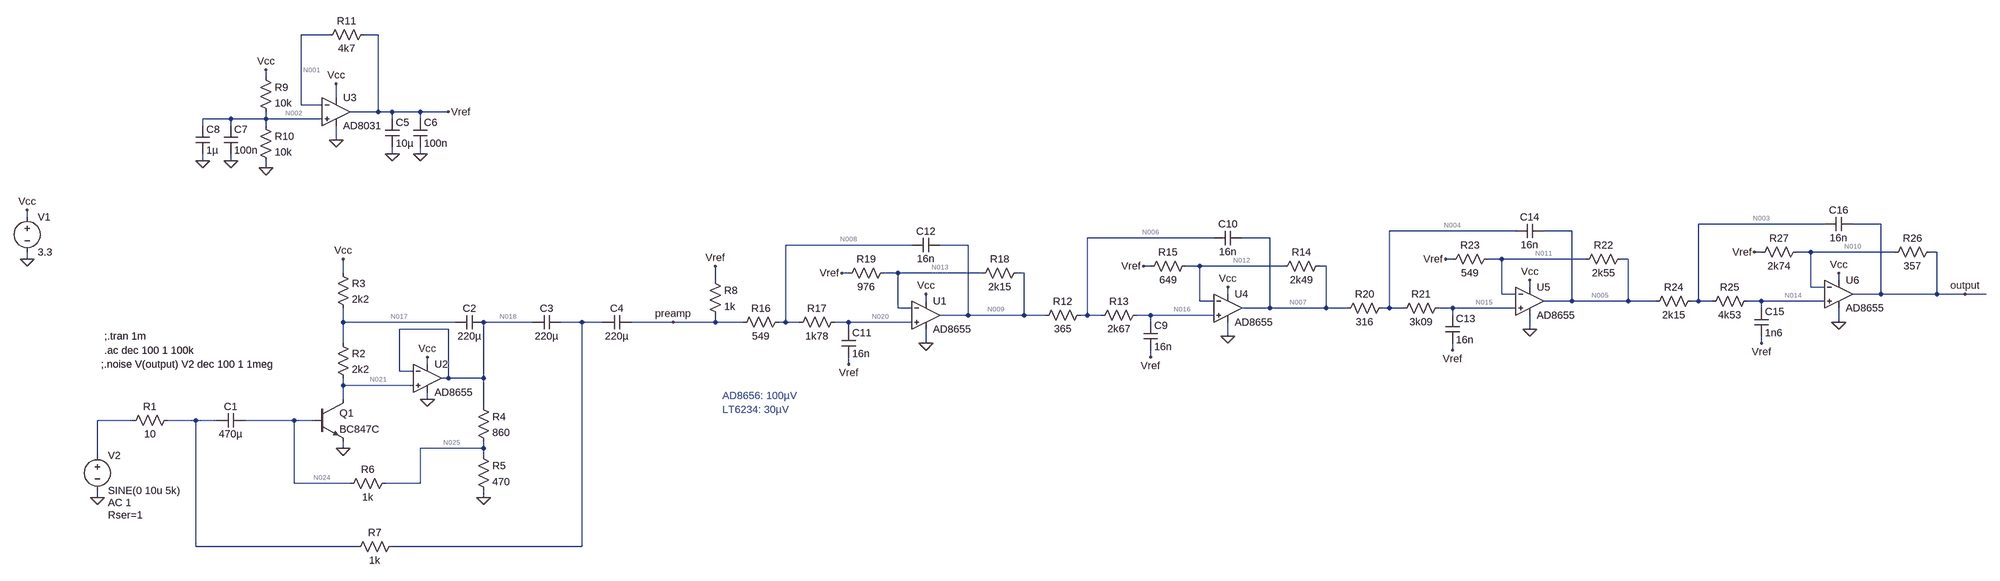
[diagram p0: schematic NPN.asc]
NPN.asc, the LTspice schematic file:
Version 4
SHEET 1 4504 900
WIRE 688 -336 624 -336
WIRE 800 -336 768 -336
WIRE 544 -240 544 -256
WIRE 704 -192 704 -224
WIRE 624 -176 624 -336
WIRE 672 -176 624 -176
WIRE 800 -160 800 -336
WIRE 800 -160 736 -160
WIRE 832 -160 800 -160
WIRE 896 -160 832 -160
WIRE 960 -160 896 -160
WIRE 464 -144 400 -144
WIRE 544 -144 544 -160
WIRE 544 -144 464 -144
WIRE 672 -144 544 -144
WIRE 832 -144 832 -160
WIRE 896 -144 896 -160
WIRE 400 -128 400 -144
WIRE 464 -128 464 -144
WIRE 544 -128 544 -144
WIRE 704 -96 704 -128
WIRE 832 -64 832 -80
WIRE 896 -64 896 -80
WIRE 400 -48 400 -64
WIRE 464 -48 464 -64
WIRE 544 -32 544 -48
WIRE 0 80 0 64
WIRE 4096 96 3808 96
WIRE 4224 96 4160 96
WIRE 3392 112 3104 112
WIRE 3520 112 3456 112
WIRE 2704 128 2416 128
WIRE 2832 128 2768 128
WIRE 2016 144 1728 144
WIRE 2144 144 2080 144
WIRE 3952 160 3936 160
WIRE 4064 160 4032 160
WIRE 4256 160 4064 160
WIRE 4352 160 4336 160
WIRE 0 176 0 160
WIRE 3248 176 3232 176
WIRE 3360 176 3328 176
WIRE 3552 176 3360 176
WIRE 3648 176 3632 176
WIRE 2560 192 2544 192
WIRE 2672 192 2640 192
WIRE 2864 192 2672 192
WIRE 2960 192 2944 192
WIRE 720 208 720 176
WIRE 1872 208 1856 208
WIRE 1984 208 1952 208
WIRE 2176 208 1984 208
WIRE 2272 208 2256 208
WIRE 1568 224 1568 192
WIRE 4128 224 4128 208
WIRE 3424 240 3424 224
WIRE 4064 240 4064 160
WIRE 4096 240 4064 240
WIRE 2736 256 2736 240
WIRE 3360 256 3360 176
WIRE 3392 256 3360 256
WIRE 4224 256 4224 96
WIRE 4224 256 4160 256
WIRE 4352 256 4352 160
WIRE 4352 256 4224 256
WIRE 4416 256 4352 256
WIRE 4464 256 4416 256
WIRE 2048 272 2048 256
WIRE 2672 272 2672 192
WIRE 2704 272 2672 272
WIRE 3520 272 3520 112
WIRE 3520 272 3456 272
WIRE 3648 272 3648 176
WIRE 3648 272 3520 272
WIRE 3712 272 3648 272
WIRE 3808 272 3808 96
WIRE 3808 272 3792 272
WIRE 3840 272 3808 272
WIRE 3952 272 3920 272
WIRE 4096 272 3952 272
WIRE 1984 288 1984 208
WIRE 2016 288 1984 288
WIRE 2832 288 2832 128
WIRE 2832 288 2768 288
WIRE 2960 288 2960 192
WIRE 2960 288 2832 288
WIRE 3008 288 2960 288
WIRE 3104 288 3104 112
WIRE 3104 288 3088 288
WIRE 3136 288 3104 288
WIRE 3248 288 3216 288
WIRE 3392 288 3248 288
WIRE 3952 288 3952 272
WIRE 2144 304 2144 144
WIRE 2144 304 2080 304
WIRE 2272 304 2272 208
WIRE 2272 304 2144 304
WIRE 2320 304 2272 304
WIRE 2416 304 2416 128
WIRE 2416 304 2400 304
WIRE 2448 304 2416 304
WIRE 2560 304 2528 304
WIRE 2704 304 2560 304
WIRE 3248 304 3248 288
WIRE 720 320 720 288
WIRE 976 320 720 320
WIRE 1152 320 1040 320
WIRE 1264 320 1216 320
WIRE 1312 320 1264 320
WIRE 1472 320 1376 320
WIRE 1568 320 1568 304
WIRE 1568 320 1472 320
WIRE 1632 320 1568 320
WIRE 1728 320 1728 144
WIRE 1728 320 1712 320
WIRE 1760 320 1728 320
WIRE 1872 320 1840 320
WIRE 2016 320 1872 320
WIRE 2560 320 2560 304
WIRE 4128 320 4128 288
WIRE 960 336 848 336
WIRE 1872 336 1872 320
WIRE 3424 336 3424 304
WIRE 2736 352 2736 320
WIRE 720 368 720 320
WIRE 2048 368 2048 336
WIRE 3952 368 3952 352
WIRE 3248 384 3248 368
WIRE 2560 400 2560 384
WIRE 912 416 912 400
WIRE 1872 416 1872 400
WIRE 848 432 848 336
WIRE 880 432 848 432
WIRE 960 448 960 336
WIRE 960 448 944 448
WIRE 1040 448 1040 320
WIRE 1040 448 960 448
WIRE 720 464 720 448
WIRE 880 464 720 464
WIRE 720 496 720 464
WIRE 912 496 912 480
WIRE 1040 512 1040 448
WIRE 240 544 160 544
WIRE 384 544 320 544
WIRE 432 544 384 544
WIRE 608 544 496 544
WIRE 656 544 608 544
WIRE 720 608 720 592
WIRE 1040 608 1040 592
WIRE 1040 608 896 608
WIRE 160 624 160 544
WIRE 1040 624 1040 608
WIRE 608 688 608 544
WIRE 736 688 608 688
WIRE 896 688 896 608
WIRE 896 688 816 688
WIRE 160 720 160 704
WIRE 1040 720 1040 704
WIRE 384 832 384 544
WIRE 752 832 384 832
WIRE 1264 832 1264 320
WIRE 1264 832 832 832
FLAG 0 176 0
FLAG 0 64 Vcc
FLAG 160 720 0
FLAG 720 608 0
FLAG 720 176 Vcc
FLAG 912 400 Vcc
FLAG 912 496 0
FLAG 1040 720 0
FLAG 1568 192 Vref
FLAG 704 -96 0
FLAG 704 -224 Vcc
FLAG 544 -256 Vcc
FLAG 544 -32 0
FLAG 832 -64 0
FLAG 896 -64 0
FLAG 960 -160 Vref
FLAG 400 -48 0
FLAG 464 -48 0
FLAG 2560 400 Vref
FLAG 2736 352 0
FLAG 2736 240 Vcc
FLAG 2544 192 Vref
FLAG 1872 416 Vref
FLAG 2048 256 Vcc
FLAG 1856 208 Vref
FLAG 4416 256 output
FLAG 3248 384 Vref
FLAG 3424 336 0
FLAG 3424 224 Vcc
FLAG 3232 176 Vref
FLAG 3952 368 Vref
FLAG 4128 320 0
FLAG 4128 208 Vcc
FLAG 3936 160 Vref
FLAG 2048 368 0
FLAG 1472 320 preamp
SYMBOL voltage 0 64 R0
WINDOW 123 0 0 Left 0
WINDOW 39 0 0 Left 0
SYMATTR InstName V1
SYMATTR Value 3.3
SYMBOL voltage 160 608 R0
WINDOW 123 24 124 Left 2
WINDOW 39 24 152 Left 2
SYMATTR Value2 AC 1
SYMATTR SpiceLine Rser=1
SYMATTR InstName V2
SYMATTR Value SINE(0 10u 5k)
SYMBOL res 336 528 R90
WINDOW 0 0 56 VBottom 2
WINDOW 3 32 56 VTop 2
SYMATTR InstName R1
SYMATTR Value 10
SYMBOL npn 656 496 R0
SYMATTR InstName Q1
SYMATTR Value BC847C
SYMBOL res 704 352 R0
SYMATTR InstName R2
SYMATTR Value 2k2
SYMBOL res 704 192 R0
SYMATTR InstName R3
SYMATTR Value 2k2
SYMBOL cap 1040 304 R90
WINDOW 0 0 32 VBottom 2
WINDOW 3 32 32 VTop 2
SYMATTR InstName C2
SYMATTR Value 220µ
SYMBOL cap 1216 304 R90
WINDOW 0 0 32 VBottom 2
WINDOW 3 32 32 VTop 2
SYMATTR InstName C3
SYMATTR Value 220µ
SYMBOL res 1024 496 R0
SYMATTR InstName R4
SYMATTR Value 860
SYMBOL res 1024 608 R0
SYMATTR InstName R5
SYMATTR Value 470
SYMBOL res 832 672 R90
WINDOW 0 0 56 VBottom 2
WINDOW 3 32 56 VTop 2
SYMATTR InstName R6
SYMATTR Value 1k
SYMBOL res 848 816 R90
WINDOW 0 0 56 VBottom 2
WINDOW 3 32 56 VTop 2
SYMATTR InstName R7
SYMATTR Value 1k
SYMBOL cap 496 528 R90
WINDOW 0 0 32 VBottom 2
WINDOW 3 32 32 VTop 2
SYMATTR InstName C1
SYMATTR Value 470µ
SYMBOL cap 1376 304 R90
WINDOW 0 0 32 VBottom 2
WINDOW 3 32 32 VTop 2
SYMATTR InstName C4
SYMATTR Value 220µ
SYMBOL res 1552 208 R0
SYMATTR InstName R8
SYMATTR Value 1k
SYMBOL res 528 -256 R0
SYMATTR InstName R9
SYMATTR Value 10k
SYMBOL res 528 -144 R0
SYMATTR InstName R10
SYMATTR Value 10k
SYMBOL cap 816 -144 R0
SYMATTR InstName C5
SYMATTR Value 10µ
SYMBOL cap 880 -144 R0
SYMATTR InstName C6
SYMATTR Value 100n
SYMBOL cap 448 -128 R0
SYMATTR InstName C7
SYMATTR Value 100n
SYMBOL cap 384 -128 R0
SYMATTR InstName C8
SYMATTR Value 1µ
SYMBOL res 784 -352 R90
WINDOW 0 0 56 VBottom 2
WINDOW 3 32 56 VTop 2
SYMATTR InstName R11
SYMATTR Value 4k7
SYMBOL OpAmps\\AD8031 704 -224 R0
SYMATTR InstName U3
SYMBOL res 2416 288 R90
WINDOW 0 0 56 VBottom 2
WINDOW 3 32 56 VTop 2
SYMATTR InstName R12
SYMATTR Value 365
SYMBOL res 2544 288 R90
WINDOW 0 0 56 VBottom 2
WINDOW 3 32 56 VTop 2
SYMATTR InstName R13
SYMATTR Value 2k67
SYMBOL cap 2544 320 R0
SYMATTR InstName C9
SYMATTR Value 16n
SYMBOL cap 2768 112 R90
WINDOW 0 0 32 VBottom 2
WINDOW 3 32 32 VTop 2
SYMATTR InstName C10
SYMATTR Value 16n
SYMBOL res 2960 176 R90
WINDOW 0 0 56 VBottom 2
WINDOW 3 32 56 VTop 2
SYMATTR InstName R14
SYMATTR Value 2k49
SYMBOL res 2656 176 R90
WINDOW 0 0 56 VBottom 2
WINDOW 3 32 56 VTop 2
SYMATTR InstName R15
SYMATTR Value 649
SYMBOL res 1728 304 R90
WINDOW 0 0 56 VBottom 2
WINDOW 3 32 56 VTop 2
SYMATTR InstName R16
SYMATTR Value 549
SYMBOL res 1856 304 R90
WINDOW 0 0 56 VBottom 2
WINDOW 3 32 56 VTop 2
SYMATTR InstName R17
SYMATTR Value 1k78
SYMBOL cap 1856 336 R0
SYMATTR InstName C11
SYMATTR Value 16n
SYMBOL cap 2080 128 R90
WINDOW 0 0 32 VBottom 2
WINDOW 3 32 32 VTop 2
SYMATTR InstName C12
SYMATTR Value 16n
SYMBOL res 2272 192 R90
WINDOW 0 0 56 VBottom 2
WINDOW 3 32 56 VTop 2
SYMATTR InstName R18
SYMATTR Value 2k15
SYMBOL res 1968 192 R90
WINDOW 0 0 56 VBottom 2
WINDOW 3 32 56 VTop 2
SYMATTR InstName R19
SYMATTR Value 976
SYMBOL res 3104 272 R90
WINDOW 0 0 56 VBottom 2
WINDOW 3 32 56 VTop 2
SYMATTR InstName R20
SYMATTR Value 316
SYMBOL res 3232 272 R90
WINDOW 0 0 56 VBottom 2
WINDOW 3 32 56 VTop 2
SYMATTR InstName R21
SYMATTR Value 3k09
SYMBOL cap 3232 304 R0
SYMATTR InstName C13
SYMATTR Value 16n
SYMBOL cap 3456 96 R90
WINDOW 0 0 32 VBottom 2
WINDOW 3 32 32 VTop 2
SYMATTR InstName C14
SYMATTR Value 16n
SYMBOL res 3648 160 R90
WINDOW 0 0 56 VBottom 2
WINDOW 3 32 56 VTop 2
SYMATTR InstName R22
SYMATTR Value 2k55
SYMBOL res 3344 160 R90
WINDOW 0 0 56 VBottom 2
WINDOW 3 32 56 VTop 2
SYMATTR InstName R23
SYMATTR Value 549
SYMBOL res 3808 256 R90
WINDOW 0 0 56 VBottom 2
WINDOW 3 32 56 VTop 2
SYMATTR InstName R24
SYMATTR Value 2k15
SYMBOL res 3936 256 R90
WINDOW 0 0 56 VBottom 2
WINDOW 3 32 56 VTop 2
SYMATTR InstName R25
SYMATTR Value 4k53
SYMBOL cap 3936 288 R0
SYMATTR InstName C15
SYMATTR Value 1n6
SYMBOL cap 4160 80 R90
WINDOW 0 0 32 VBottom 2
WINDOW 3 32 32 VTop 2
SYMATTR InstName C16
SYMATTR Value 16n
SYMBOL res 4352 144 R90
WINDOW 0 0 56 VBottom 2
WINDOW 3 32 56 VTop 2
SYMATTR InstName R26
SYMATTR Value 357
SYMBOL res 4048 144 R90
WINDOW 0 0 56 VBottom 2
WINDOW 3 32 56 VTop 2
SYMATTR InstName R27
SYMATTR Value 2k74
SYMBOL OpAmps\\AD8655 2048 240 R0
SYMATTR InstName U1
SYMBOL OpAmps\\AD8655 912 384 R0
SYMATTR InstName U2
SYMBOL OpAmps\\AD8655 2736 224 R0
SYMATTR InstName U4
SYMBOL OpAmps\\AD8655 3424 208 R0
SYMATTR InstName U5
SYMBOL OpAmps\\AD8655 4128 192 R0
SYMATTR InstName U6
TEXT 176 352 Left 2 !;.tran 1m
TEXT 176 384 Left 2 !.ac dec 100 1 100k
TEXT 168 416 Left 2 !;.noise V(output) V2 dec 100 1 1meg
TEXT 1584 488 Left 2 ;AD8656: 100µV\nLT6234: 30µV

The netlist it stands for:
* NPN.asc
V1 Vcc 0 3.3
V2 N022 0 SINE(0 10u 5k) AC 1 Rser=1
R1 N023 N022 10
Q1 N021 N024 0 0 BC847C
R2 N017 N021 2k2
R3 Vcc N017 2k2
C2 N018 N017 220µ
C3 N019 N018 220µ
R4 N018 N025 860
R5 N025 0 470
R6 N025 N024 1k
R7 N019 N023 1k
C1 N024 N023 470µ
C4 preamp N019 220µ
R8 Vref preamp 1k
R9 Vcc N002 10k
R10 N002 0 10k
C5 Vref 0 10µ
C6 Vref 0 100n
C7 N002 0 100n
C8 N002 0 1µ
R11 Vref N001 4k7
XU3 N002 N001 Vcc 0 Vref AD8031  ; pins In+ In- V+ V- OUT
R12 N006 N009 365
R13 N016 N006 2k67
C9 N016 Vref 16n
C10 N007 N006 16n
R14 N007 N012 2k49
R15 N012 Vref 649
R16 N008 preamp 549
R17 N020 N008 1k78
C11 N020 Vref 16n
C12 N009 N008 16n
R18 N009 N013 2k15
R19 N013 Vref 976
R20 N004 N007 316
R21 N015 N004 3k09
C13 N015 Vref 16n
C14 N005 N004 16n
R22 N005 N011 2k55
R23 N011 Vref 549
R24 N003 N005 2k15
R25 N014 N003 4k53
C15 N014 Vref 1n6
C16 output N003 16n
R26 output N010 357
R27 N010 Vref 2k74
XU1 N020 N013 Vcc 0 N009 AD8655  ; pins In+ In- V+ V- OUT
XU2 N021 N018 Vcc 0 N018 AD8655  ; pins In+ In- V+ V- OUT
XU4 N016 N012 Vcc 0 N007 AD8655  ; pins In+ In- V+ V- OUT
XU5 N015 N011 Vcc 0 N005 AD8655  ; pins In+ In- V+ V- OUT
XU6 N014 N010 Vcc 0 output AD8655  ; pins In+ In- V+ V- OUT
.model NPN NPN
.model PNP PNP
.lib standard.bjt
;.tran 1m
.ac dec 100 1 100k
;.noise V(output) V2 dec 100 1 1meg
* AD8656: 100µV
* LT6234: 30µV
.backanno
.end

* Results of the author's LTspice run, read from the files saved beside the schematic
* Operating Point, zero values left out:
*   V(vcc) = 3.3 V
*   V(n021) = 1.731 V
*   V(n024) = 610.5 mV
*   V(n017) = 2.516 V
*   V(n018) = 1.731 V
*   V(n025) = 611.4 mV
*   V(preamp) = 1.65 V
*   V(vref) = 1.65 V
*   V(n002) = 1.652 V
*   V(n001) = 1.652 V
*   V(n006) = 1.65 V
*   V(n009) = 1.65 V
*   V(n016) = 1.65 V
*   V(n007) = 1.651 V
*   V(n012) = 1.65 V
*   V(n008) = 1.65 V
*   V(n020) = 1.65 V
*   V(n013) = 1.65 V
*   V(n004) = 1.651 V
*   V(n015) = 1.651 V
*   V(n005) = 1.656 V
*   V(n011) = 1.651 V
*   V(n003) = 1.656 V
*   V(n014) = 1.656 V
*   V(output) = 1.657 V
*   V(n010) = 1.656 V
*   Ic(Q1) = 356.6 µA
*   Ib(Q1) = 974 nA
*   Ie(Q1) = -357.6 µA
*   I(R2) = 356.6 µA
*   I(R3) = 356.6 µA
*   I(R4) = 1.302 mA
*   I(R5) = 1.301 mA
*   I(R6) = 974 nA
*   I(R8) = 17.27 pA
*   I(R9) = 164.8 µA
*   I(R10) = 165.2 µA
*   I(R11) = -450 nA
*   I(R12) = -14.03 pA
*   I(R13) = -14.03 pA
*   I(R14) = 331 nA
*   I(R15) = 331 nA
*   I(R16) = -17.27 pA
*   I(R17) = -17.27 pA
*   I(R18) = 52.36 nA
*   I(R19) = 52.36 nA
*   I(R20) = -11.21 pA
*   I(R21) = -11.21 pA
*   I(R22) = 1.986 µA
*   I(R23) = 1.986 µA
*   I(R24) = 1.569 pA
*   I(R25) = 1.569 pA
*   I(R26) = 2.264 µA
*   I(R27) = 2.264 µA
*   I(V1) = -20.98 mA
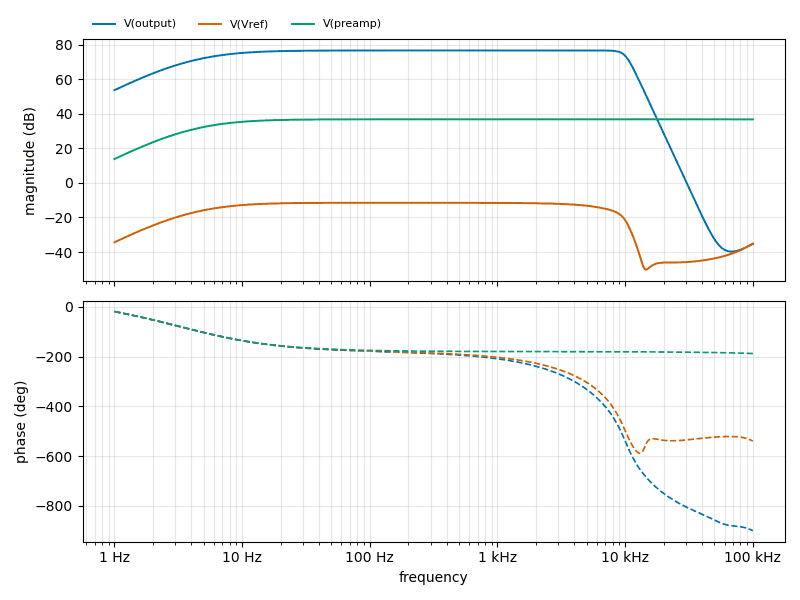
[diagram p1: AC Analysis of NPN.asc, plotted from the saved traces]
* AC Analysis, 1 run:
*   V(output): 53.70 dB at 1 Hz, -35.23 dB at 100 kHz, peak 76.73 dB at 3.981 kHz, 3 dB below the peak at 6.511 Hz and 9.956 kHz
*   V(Vref): -34.36 dB at 1 Hz, -35.15 dB at 100 kHz, peak -11.51 dB at 162.2 Hz, 3 dB below the peak at 6.294 Hz and 6.563 kHz
*   V(preamp): 13.84 dB at 1 Hz, 36.78 dB at 100 kHz, peak 36.84 dB at 1.585 kHz, 3 dB below the peak at 6.487 Hz